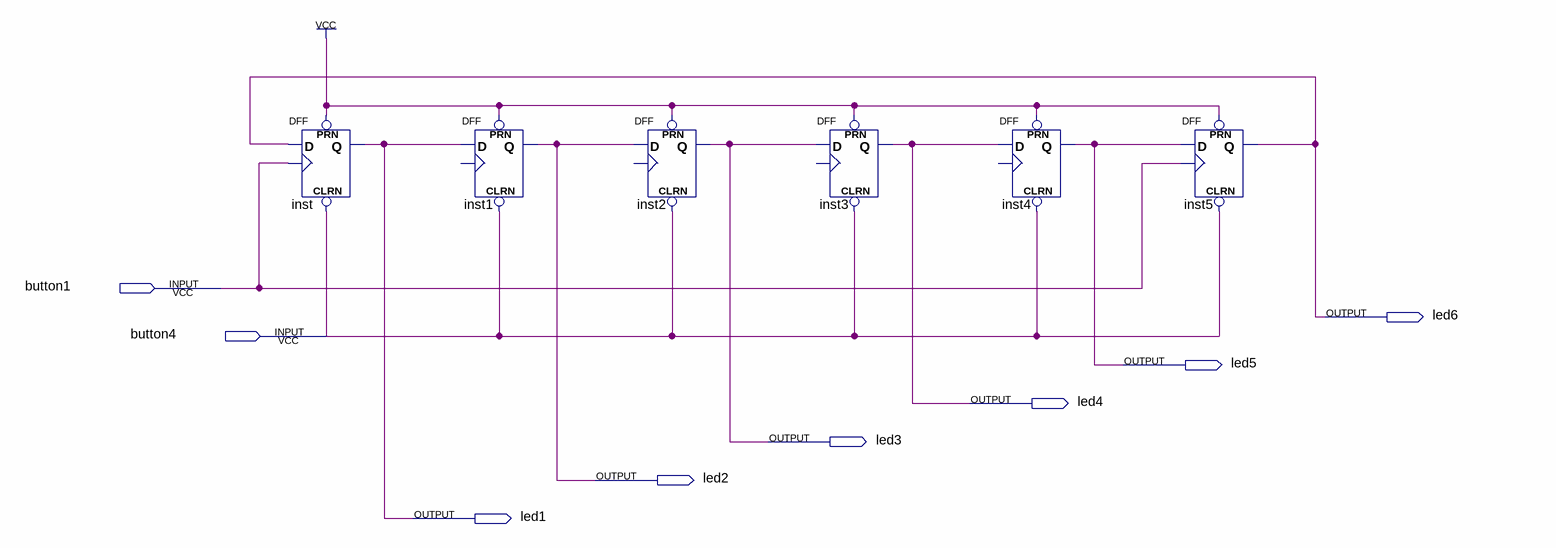
[diagram p0: schematic sheet]
// Quartus schematic Ring_counter_6bit.bdf as structural Verilog: 6 symbols, 8 pins
module Ring_counter_6bit (
  input  button1,
  input  button4,
  output led6,
  output led5,
  output led4,
  output led3,
  output led2,
  output led1
);

  DFF inst (.CLRN(button4), .CLK(button1), .D(led6), .PRN(1'b1), .Q(led1));
  DFF inst1 (.CLRN(button4), .D(led1), .PRN(1'b1), .Q(led2));  // open: CLK
  DFF inst2 (.CLRN(button4), .D(led2), .PRN(1'b1), .Q(led3));  // open: CLK
  DFF inst3 (.CLRN(button4), .D(led3), .PRN(1'b1), .Q(led4));  // open: CLK
  DFF inst4 (.CLRN(button4), .D(led4), .PRN(1'b1), .Q(led5));  // open: CLK
  DFF inst5 (.CLRN(button4), .CLK(button1), .D(led5), .PRN(1'b1), .Q(led6));
endmodule
